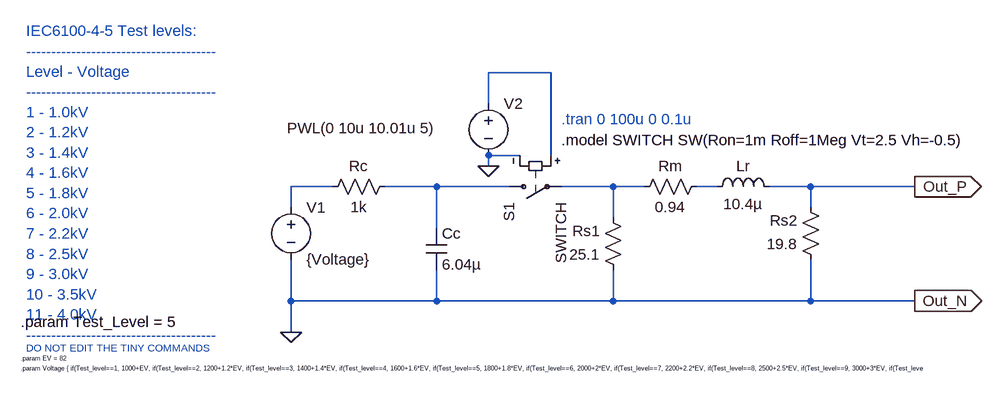
[diagram p0: schematic SurgeTester.asc]
SurgeTester.asc, the LTspice schematic file:
Version 4
SHEET 1 4016 680
WIRE 336 -80 240 -80
WIRE 240 -32 240 -80
WIRE 288 48 240 48
WIRE 336 48 336 -80
WIRE 240 64 240 48
WIRE 0 96 -64 96
WIRE 160 96 80 96
WIRE 272 96 160 96
WIRE 432 96 352 96
WIRE 480 96 432 96
WIRE 592 96 560 96
WIRE 736 96 672 96
WIRE 896 96 736 96
WIRE -64 128 -64 96
WIRE 736 128 736 96
WIRE 432 144 432 96
WIRE 160 160 160 96
WIRE -64 272 -64 208
WIRE 160 272 160 224
WIRE 160 272 -64 272
WIRE 432 272 432 224
WIRE 432 272 160 272
WIRE 736 272 736 208
WIRE 736 272 432 272
WIRE 896 272 736 272
WIRE -64 320 -64 272
FLAG 240 64 0
FLAG -64 320 0
FLAG 896 96 Out_P
IOPIN 896 96 Out
FLAG 896 272 Out_N
IOPIN 896 272 Out
SYMBOL voltage -64 112 R0
WINDOW 123 0 0 Left 0
WINDOW 39 0 0 Left 0
SYMATTR InstName V1
SYMATTR Value {Voltage}
SYMBOL voltage 240 -48 R0
WINDOW 3 -310 54 Left 2
WINDOW 123 0 0 Left 0
WINDOW 39 0 0 Left 0
SYMATTR InstName V2
SYMATTR Value PWL(0 10u 10.01u 5)
SYMBOL res 96 80 R90
WINDOW 0 0 56 VBottom 2
WINDOW 3 32 56 VTop 2
SYMATTR InstName Rc
SYMATTR Value 1k
SYMBOL res 576 80 R90
WINDOW 0 0 56 VBottom 2
WINDOW 3 32 56 VTop 2
SYMATTR InstName Rm
SYMATTR Value 0.94
SYMBOL res 448 240 R180
WINDOW 0 36 76 Left 2
WINDOW 3 36 40 Left 2
SYMATTR InstName Rs1
SYMATTR Value 25.1
SYMBOL res 752 224 R180
WINDOW 0 36 76 Left 2
WINDOW 3 36 40 Left 2
SYMATTR InstName Rs2
SYMATTR Value 19.8
SYMBOL sw 256 96 M90
SYMATTR InstName S1
SYMATTR Value SWITCH
SYMBOL cap 144 160 R0
SYMATTR InstName Cc
SYMATTR Value 6.04µ
SYMBOL ind 576 112 R270
WINDOW 0 32 56 VTop 2
WINDOW 3 5 56 VBottom 2
SYMATTR InstName Lr
SYMATTR Value 10.4µ
TEXT 352 24 Left 2 !.model SWITCH SW(Ron=1m Roff=1Meg Vt=2.5 Vh=-0.5)
TEXT 352 -8 Left 2 ;.tran 0 100u 0 0.1u
TEXT -472 -144 Left 2 ;IEC6100-4-5 Test levels:\n--------------------------------------\nLevel - Voltage\n--------------------------------------\n1 - 1.0kV\n2 - 1.2kV\n3 - 1.4kV\n4 - 1.6kV\n5 - 1.8kV\n6 - 2.0kV\n7 - 2.2kV\n8 - 2.5kV\n9 - 3.0kV\n10 - 3.5kV\n11 - 4.0kV\n--------------------------------------
TEXT -480 304 Left 2 !.param Test_Level = 5
TEXT -480 376 Left 0 !.param Voltage { if(Test_level==1, 1000+EV, if(Test_level==2, 1200+1.2*EV, if(Test_level==3, 1400+1.4*EV, if(Test_level==4, 1600+1.6*EV, if(Test_level==5, 1800+1.8*EV, if(Test_level==6, 2000+2*EV, if(Test_level==7, 2200+2.2*EV, if(Test_level==8, 2500+2.5*EV, if(Test_level==9, 3000+3*EV, if(Test_level==10, 3500+3.5*EV, if(Test_level==11, 4000+4*EV, 0)))))))))))}
TEXT -480 360 Left 0 !.param EV = 82
TEXT -472 344 Left 1 ;DO NOT EDIT THE TINY COMMANDS

The netlist it stands for:
* SurgeTester.asc
V1 N002 0 {Voltage}
V2 N001 0 PWL(0 10u 10.01u 5)
Rc N003 N002 1k
Rm N005 N004 0.94
Rs1 0 N004 25.1
Rs2 0 Out_P 19.8
S1 N003 N004 N001 0 SWITCH
Cc N003 0 6.04µ
Lr N005 Out_P 10.4µ
.model SWITCH SW(Ron=1m Roff=1Meg Vt=2.5 Vh=-0.5)
* .tran 0 100u 0 0.1u
* IEC6100-4-5 Test levels:
* --------------------------------------
* Level - Voltage
* --------------------------------------
* 1 - 1.0kV
* 2 - 1.2kV
* 3 - 1.4kV
* 4 - 1.6kV
* 5 - 1.8kV
* 6 - 2.0kV
* 7 - 2.2kV
* 8 - 2.5kV
* 9 - 3.0kV
* 10 - 3.5kV
* 11 - 4.0kV
* --------------------------------------
.param Test_Level = 5
.param Voltage { if(Test_level==1, 1000+EV, if(Test_level==2, 1200+1.2*EV, if(Test_level==3, 1400+1.4*EV, if(Test_level==4, 1600+1.6*EV, if(Test_level==5, 1800+1.8*EV, if(Test_level==6, 2000+2*EV, if(Test_level==7, 2200+2.2*EV, if(Test_level==8, 2500+2.5*EV, if(Test_level==9, 3000+3*EV, if(Test_level==10, 3500+3.5*EV, if(Test_level==11, 4000+4*EV, 0)))))))))))}
.param EV = 82
* DO NOT EDIT THE TINY COMMANDS
.backanno
.end